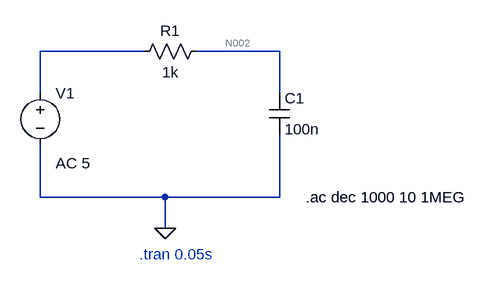
[diagram p0: schematic Draft3.asc]
Draft3.asc, the LTspice schematic file:
Version 4.1
SHEET 1 880 680
WIRE 224 16 64 16
WIRE 432 16 304 16
WIRE 64 80 64 16
WIRE 432 80 432 16
WIRE 64 240 64 160
WIRE 256 240 64 240
WIRE 432 240 432 144
WIRE 432 240 256 240
WIRE 256 288 256 240
FLAG 256 288 0
SYMBOL voltage 64 64 R0
WINDOW 123 24 124 Left 2
WINDOW 39 0 0 Left 0
SYMATTR InstName V1
SYMATTR Value ""
SYMATTR Value2 AC 5
SYMBOL res 320 0 R90
WINDOW 0 0 56 VBottom 2
WINDOW 3 32 56 VTop 2
SYMATTR InstName R1
SYMATTR Value 1k
SYMBOL cap 416 80 R0
SYMATTR InstName C1
SYMATTR Value 100n
TEXT 216 328 Left 2 ;.tran 0.05s
TEXT 472 240 Left 2 !.ac dec 1000 10 1MEG

The netlist it stands for:
* Draft3.asc
V1 N001 0 AC 5
R1 N002 N001 1k
C1 N002 0 100n
* .tran 0.05s
.ac dec 1000 10 1MEG
.backanno
.end

* Results of the author's LTspice run, read from the files saved beside the schematic
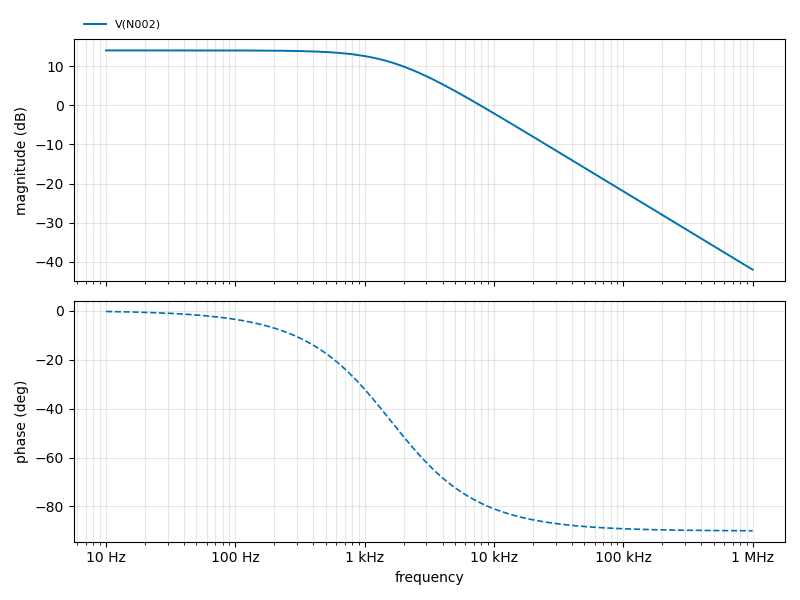
[diagram p1: AC Analysis of Draft3.asc, plotted from the saved traces]
* AC Analysis, 1 run:
*   V(N002): 13.98 dB at 10 Hz, -41.98 dB at 1 MHz, peak 13.98 dB at 10 Hz, 3 dB below the peak at 1.592 kHz